# EAGLE schematic Integration board_3008 (EAGLE 9.3.0)
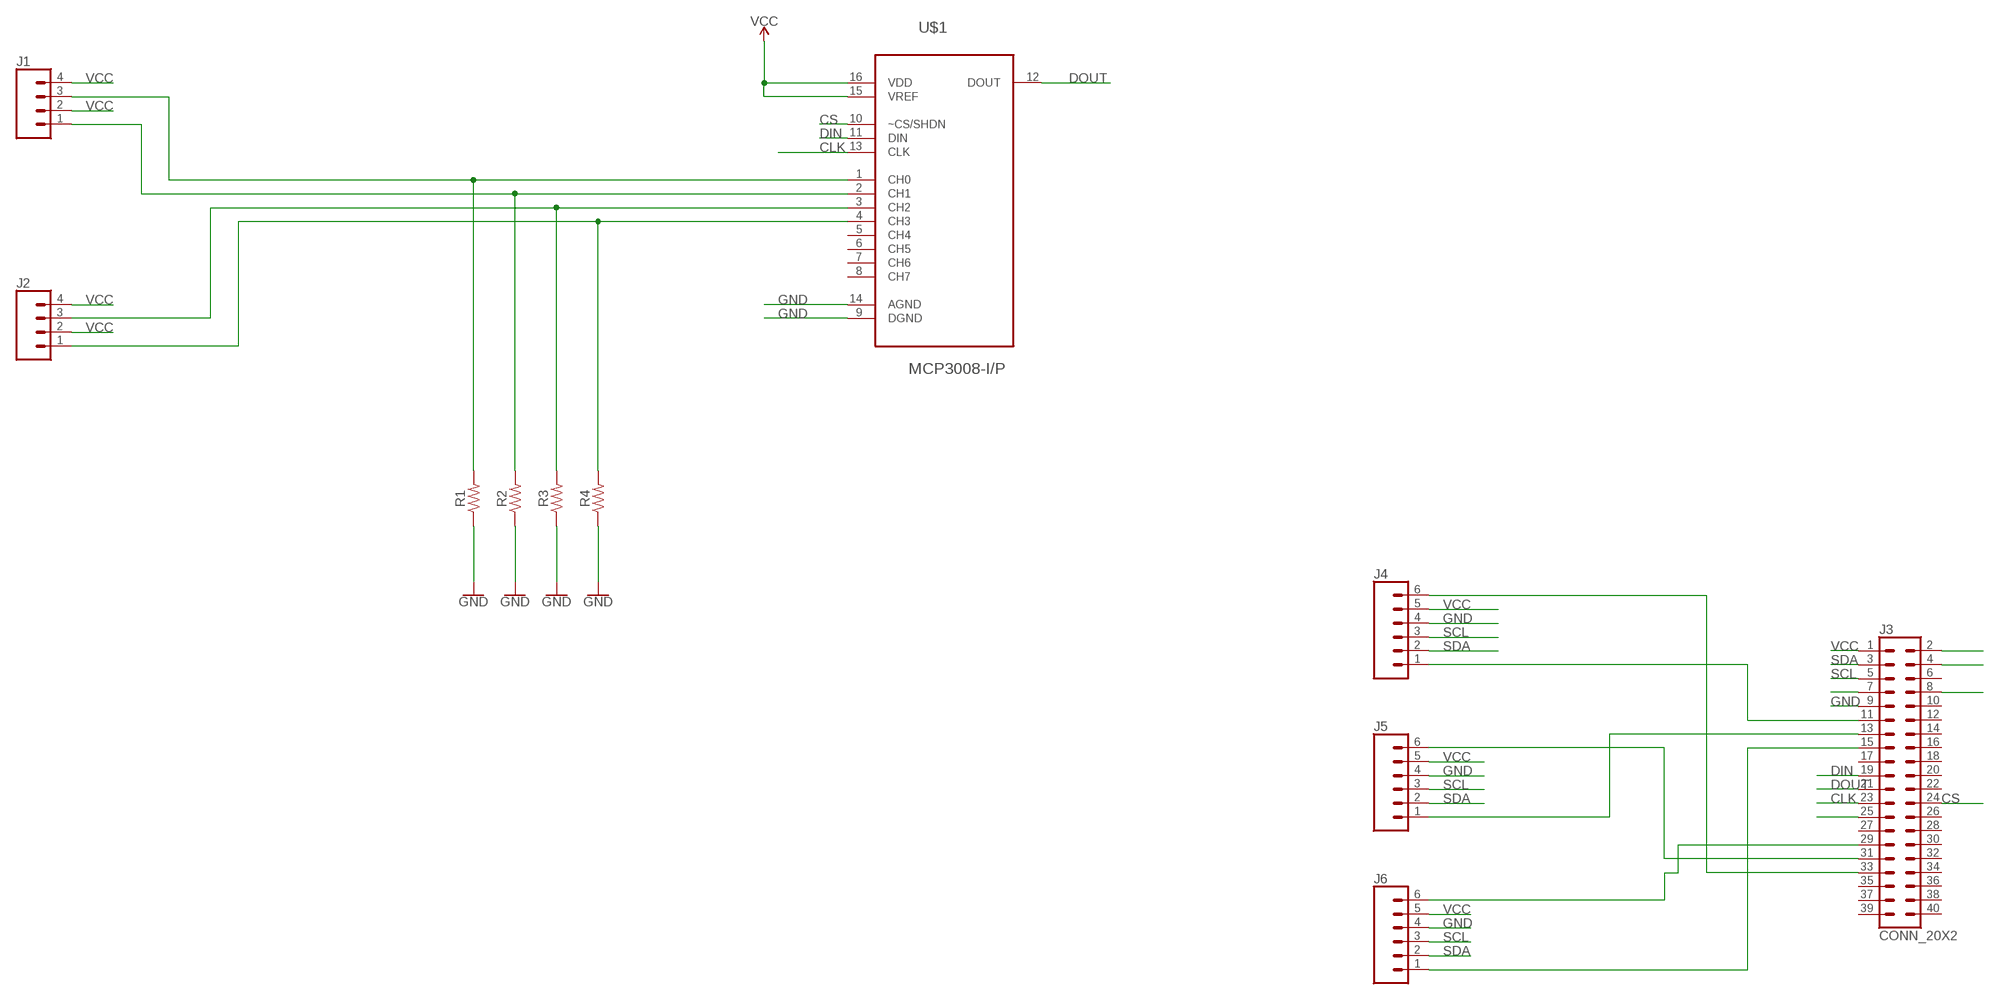
[diagram p0: schematic, sheet 1]

## Parts
J1  CONN_04PTH  [1X04]
J2  CONN_04PTH  [1X04]
J3  CONN_20X2  [2X20]
J4  CONN_06SILK_FEMALE_PTH  [1X06]
J5  CONN_06SILK_FEMALE_PTH  [1X06]
J6  CONN_06SILK_FEMALE_PTH  [1X06]
R1  RESISTORAXIAL-0.3  [AXIAL-0.3]
R2  RESISTORAXIAL-0.3  [AXIAL-0.3]
R3  RESISTORAXIAL-0.3  [AXIAL-0.3]
R4  RESISTORAXIAL-0.3  [AXIAL-0.3]
U$1  MCP3008-I/P  [DIP254P762X432-16]

## Nets
CLK: J3.23 U$1.13(CLK)
CS: J3.24 U$1.10(~CS/SHDN)
DIN: J3.19 U$1.11(DIN)
DOUT: J3.21 U$1.12(DOUT)
GND: J3.9 J4.4 J5.4 J6.4 R1.P$1 R2.P$1 R3.P$1 R4.P$1 U$1.9(DGND) U$1.14(AGND)
N$1: J1.3 R1.P$2 U$1.1(CH0)
N$2: J3.11 J4.1
N$3: J2.3 R3.P$2 U$1.3(CH2)
N$4: J2.1 R4.P$2 U$1.4(CH3)
N$5: J3.13 J5.1
N$6: J3.29 J6.6
N$7: J3.31 J5.6
N$8: J3.7
N$9: J3.2
N$10: J3.4
N$12: J3.8
N$13: J3.25
N$15: J1.1 R2.P$2 U$1.2(CH1)
N$17: J3.33 J4.6
N$29: J3.15 J6.1
SCL: J3.5 J4.3 J5.3 J6.3
SDA: J3.3 J4.2 J5.2 J6.2
VCC: J1.2 J1.4 J2.2 J2.4 J3.1 J4.5 J5.5 J6.5 U$1.15(VREF) U$1.16(VDD)
Unconnected: J3.6 J3.10 J3.12 J3.14 J3.16 J3.17 J3.18 J3.20 J3.22 J3.26 J3.27 J3.28 J3.30 J3.32 J3.34 J3.35 J3.36 J3.37 J3.38 J3.39 J3.40 U$1.5(CH4) U$1.6(CH5) U$1.7(CH6) U$1.8(CH7)

## Library data of the parts
J1 J2 = SparkFun-Connectors:CONN_04: Multi connection point. Often used as Generic Header-pin footprint for 0.1 inch spaced/style header connections On any of the 0.1 inch spaced packages, you can populate with these: Break Away Headers - Straight <https://www.sparkfun.com/products/116> (PRT-00116) Break Away Male Headers - Right Angle <https://www.sparkfun.com/products/553> (PRT-00553) Female Headers <https://www.sparkfun.com/products/115> (PRT-00115) Break Away Headers - Machine Pin <https://www.sparkfun.com/products/117> (PRT-00117) Break Away Female Headers - Swiss Machine Pin <https://www.sparkfun.com/products/743> (PRT-00743) For SCREWTERMINALS and SPRING TERMINALS visit here: Screw Terimnals on SparkFun.com <https://www.sparkfun.com/search/results?term=Screw+Terminals> (5mm/3.5mm/2.54mm spacing) This device is also useful as a general connection point to wire up your design to another part of your project. Our various solder wires solder well into these plated through hole pads. Hook-Up Wire - Assortment (Stranded, 22 AWG) <https://www.sparkfun.com/products/11375> (PRT-11375) Hook-Up Wire - Assortment (Solid Core, 22 AWG) <https://www.sparkfun.com/products/11367> (PRT-11367) View the entire wire category on our website here <https://www.sparkfun.com/categories/141> Special notes: Molex polarized connector foot print use with SKU : PRT-08231 with associated crimp pins and housings. 1MM SMD Version SKU: PRT-10208; PROD_ID: CONN-09696
J3 = SparkFun-Connectors:CONN_20X2: Multi connection point. Often used as Generic Header-pin footprint for 0.1 inch spaced/style header connections On any of the 0.1 inch spaced packages, you can populate with these: Break Away Headers - Straight <https://www.sparkfun.com/products/116> (PRT-00116) Break Away Male Headers - Right Angle <https://www.sparkfun.com/products/553> (PRT-00553) Female Headers <https://www.sparkfun.com/products/115> (PRT-00115) Break Away Headers - Machine Pin <https://www.sparkfun.com/products/117> (PRT-00117) Break Away Female Headers - Swiss Machine Pin <https://www.sparkfun.com/products/743> (PRT-00743)
J4-J6 = SparkFun-Connectors:CONN_06: Multi connection point. Often used as Generic Header-pin footprint for 0.1 inch spaced/style header connections On any of the 0.1 inch spaced packages, you can populate with these: Break Away Headers - Straight <https://www.sparkfun.com/products/116> (PRT-00116) Break Away Male Headers - Right Angle <https://www.sparkfun.com/products/553> (PRT-00553) Female Headers <https://www.sparkfun.com/products/115> (PRT-00115) Break Away Headers - Machine Pin <https://www.sparkfun.com/products/117> (PRT-00117) Break Away Female Headers - Swiss Machine Pin <https://www.sparkfun.com/products/743> (PRT-00743) Arduino Stackable Header - 6 Pin <https://www.sparkfun.com/products/9280> (PRT-09280) For SCREWTERMINALS and SPRING TERMINALS visit here: Screw Terimnals on SparkFun.com <https://www.sparkfun.com/search/results?term=Screw+Terminals> (5mm/3.5mm/2.54mm spacing) This device is also useful as a general connection point to wire up your design to another part of your project. Our various solder wires solder well into these plated through hole pads. Hook-Up Wire - Assortment (Stranded, 22 AWG) <https://www.sparkfun.com/products/11375> (PRT-11375) Hook-Up Wire - Assortment (Solid Core, 22 AWG) <https://www.sparkfun.com/products/11367> (PRT-11367) View the entire wire category on our website here <https://www.sparkfun.com/categories/141>; PROD_ID: CONN-08437
R1-R4 = SparkFun-Resistors:RESISTOR: Generic Resistor Package
U$1 = MPU3008:MCP3008-I/P: ADC; MPN: MCP3008-I/P; OC_FARNELL: 1627174; OC_NEWARK: 19C7200; PACKAGE: DIP-16; SUPPLIER: Microchip